# EAGLE design BC 09.02 (EAGLE 5.04)
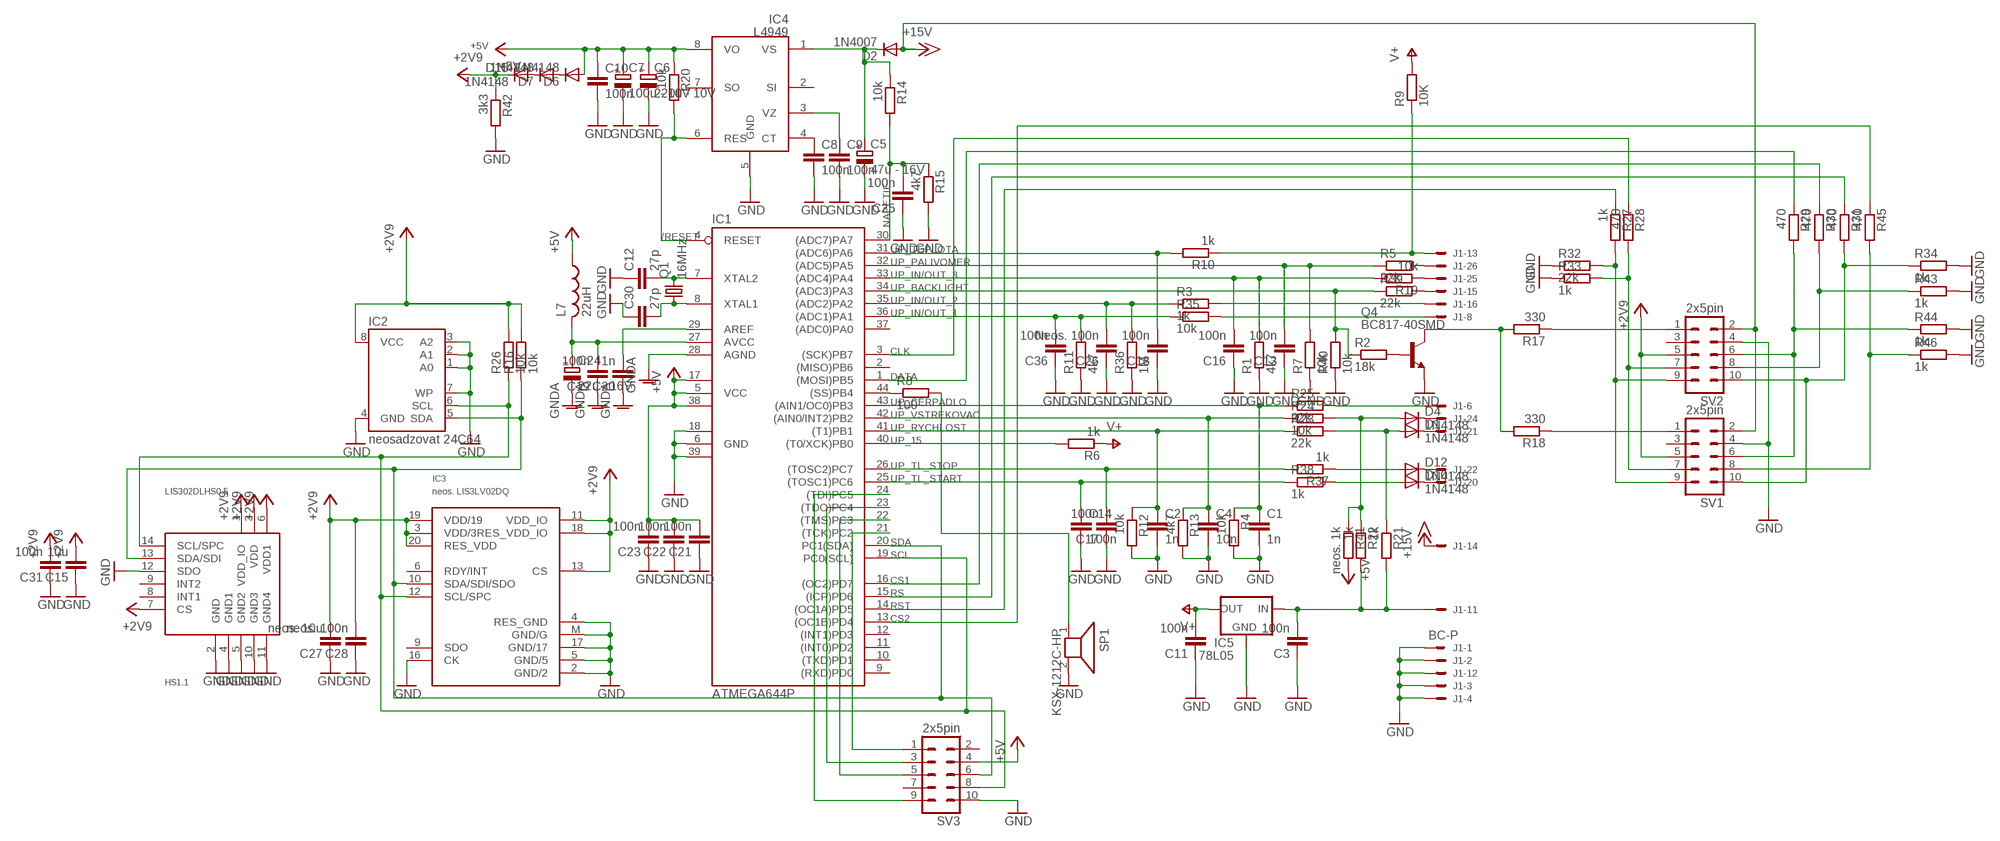
[diagram p0: schematic, sheet 1]

## Parts
C1  1n  C-EUC0805K  [C0805K]
C2  1n  C-EUC0805K  [C0805K]
C3  100n  C-EUC0805K  [C0805K]
C4  10n  C-EUC0805K  [C0805K]
C5  47u - 16V  CPOL-EUCT7343  [CT7343]
C6  220u - 10V  CPOL-EUCT7343  [CT7343]
C7  100u - 10V  CPOL-EUCT7343  [CT7343]
C8  100n  C-EUC0805K  [C0805K]
C9  100n  C-EUC0805K  [C0805K]
C10  100n  C-EUC0805K  [C0805K]
C11  100n  C-EUC0805K  [C0805K]
C12  27p  C-EUC0805K  [C0805K]
C13  100n  C-EUC0805K  [C0805K]
C14  100n  C-EUC0805K  [C0805K]
C15  10u  C-EUC0805K  [C0805K]
C16  100n  C-EUC0805K  [C0805K]
C17  100n  C-EUC0805K  [C0805K]
C18  100n  C-EUC0805K  [C0805K]
C19  100n  C-EUC0805K  [C0805K]
C20  1n  C-EUC0805K  [C0805K]
C21  100n  C-EUC0603K  [C0603K]
C22  100n  C-EUC0603K  [C0603K]
C23  100n  C-EUC0603K  [C0603K]
C24  22u - 16V  CPOL-EUCT6032  [CT6032]
C25  100n  C-EUC0805K  [C0805K]
C26  Neos. 100n  C-EUC0805K  [C0805K]
C27  neos. 10u  C-EUC0805K  [C0805K]
C28  neos. 100n  C-EUC0805K  [C0805K]
C30  27p  C-EUC0805K  [C0805K]
C31  100n  C-EUC0805K  [C0805K]
C36  100n  C-EUC0805K  [C0805K]
D1  1N4148  DIODE-0805  [D0805]
D2  1N4007  DIODE-DO214AA  [DO214AA]
D4  1N4148  DIODE-0805  [D0805]
D6  1N4148  DIODE-0805  [D0805]
D7  1N4148  DIODE-0805  [D0805]
D10  1N4148  DIODE-0805  [D0805]
D12  1N4148  DIODE-0805  [D0805]
D15  1N4148  DIODE-0805  [D0805]
HS1.1  LIS302DLHS0.5  [LGA14-0.5]
IC1  ATMEGA644P  MEGA16-A  [TQFP44]
IC2  neosadzovat 24C64  AT24C  [SOIC8]
IC3  neos. LIS3LV02DQ  LIS3LV02DQ  [QFN24]
IC4  L4949  L4949SMD  [SO08]
IC5  78L05  78LXX  [TO92]
J1  BC-P  [BC]
L7  22uH  L-USL3230M  [L3230M]
Q1  16MHz  CRYSTALHC49UP  [HC49UP]
Q4  BC817-40SMD  [SOT23-BEC]
R1  4k7  R-EU_M0805  [M0805]
R2  18k  R-EU_M0805  [M0805]
R3  1k  R-EU_M0805  [M0805]
R4  10k  R-EU_M0805  [M0805]
R5  22k  R-EU_M0805  [M0805]
R6  1k  R-EU_M0805  [M0805]
R7  10k  R-EU_M0805  [M0805]
R8  100  R-EU_M0805  [M0805]
R9  10K  R-EU_M0805  [M0805]
R10  1k  R-EU_M0805  [M0805]
R11  4k7  R-EU_M0805  [M0805]
R12  10k  R-EU_M0805  [M0805]
R13  4k7  R-EU_M0805  [M0805]
R14  10k  R-EU_M0805  [M0805]
R15  4k7  R-EU_M0805  [M0805]
R16  10k  R-EU_M0805  [M0805]
R17  330  R-EU_M0805  [M0805]
R18  330  R-EU_M0805  [M0805]
R19  10k  R-EU_M0805  [M0805]
R20  10k  R-EU_M0805  [M0805]
R21  1k  R-EU_M0805  [M0805]
R22  1k  R-EU_M0805  [M0805]
R23  22k  R-EU_M0805  [M0805]
R24  10k  R-EU_M0805  [M0805]
R25  22k  R-EU_M0805  [M0805]
R26  10k  R-EU_M0805  [M0805]
R27  1k  R-EU_M0805  [M0805]
R28  470  R-EU_M0805  [M0805]
R29  470  R-EU_M0805  [M0805]
R30  470  R-EU_M0805  [M0805]
R31  470  R-EU_M0805  [M0805]
R32  22k  R-EU_M0805  [M0805]
R33  1k  R-EU_M0805  [M0805]
R34  1k  R-EU_M0805  [M0805]
R35  10k  R-EU_M0805  [M0805]
R36  1M  R-EU_M0805  [M0805]
R37  1k  R-EU_M0805  [M0805]
R38  1k  R-EU_M0805  [M0805]
R39  22k  R-EU_M0805  [M0805]
R40  10k  R-EU_M0805  [M0805]
R41  neos. 1k  R-EU_M0805  [M0805]
R42  3k3  R-EU_M0805  [M0805]
R43  1k  R-EU_M0805  [M0805]
R44  1k  R-EU_M0805  [M0805]
R45  470  R-EU_M0805  [M0805]
R46  1k  R-EU_M0805  [M0805]
SP1  KSX-1212C-HP  AL60P  [AL60P]
SV1  2x5pin  MA05-2  [MA05-2]
SV2  2x5pin  MA05-2  [MA05-2]
SV3  2x5pin  MA05-2  [MA05-2]

## Nets
15: C3.2 IC5.3(IN) J1.11 R21.2 R22.2
+3V3: C15.2 C27.2 C28.2 C31.2 D15.2(C) HS1.1.1(VDD_IO) HS1.1.3(VDD) HS1.1.6(VDD1) HS1.1.7(CS) IC2.8(VCC) IC3.3(VDD/3) IC3.11(VDD_IO) IC3.13(CS) IC3.18(RES_VDD_IO) IC3.19(VDD/19) IC3.20(RES_VDD) R16.2 R26.2 R42.1 SV1.5 SV2.5 ; supply symbol labelled +2V9
+5V: C6.+ C7.+ C10.1 C21.2 C22.2 C23.2 D6.1(A) IC1.5(VCC) IC1.17(VCC1) IC1.38(VCC2) IC4.8(VO) L7.1 R20.1 R41.2 SV3.4
+15V: D2.A J1.14 SV1.2 SV2.2
/RESET: IC1.4(RESET) IC4.6(RES) R20.2
AREF: C20.2 IC1.29(AREF)
AVCC: C19.2 C24.+ IC1.27(AVCC) L7.2
BACK_LIGHT: J1.15 R39.2
BL-: R17.1 SV2.1
CERPADLO: J1.6 R25.2
CLK: IC1.3((SCK)PB7) R28.1
CLKL: R28.2 R33.2 SV1.7 SV2.7
CS1: IC1.16((OC2)PD7) R30.1
CS1L: R45.2 R46.1 SV1.8
CS2: IC1.13((OC1B)PD4) R45.1
CSL: R30.2 R43.1 SV2.8
DATA: IC1.1((MOSI)PB5) R29.1
DATAL: R29.2 R44.1 SV1.6 SV2.6
GND: C1.2 C2.2 C3.1 C4.2 C5.- C6.- C7.- C8.2 C9.2 C10.2 C11.1 C12.1 C13.1 C14.2 C15.1 C16.1 C17.1 C18.1 C21.1 C22.1 C23.1 C25.1 C26.1 C27.1 C28.1 C30.1 C31.1 C36.1 HS1.1.2(GND) HS1.1.4(GND1) HS1.1.5(GND2) HS1.1.10(GND3) HS1.1.11(GND4) HS1.1.12(SDO) IC1.6(GND) IC1.18(GND1) IC1.39(GND2) IC2.1(A0) IC2.2(A1) IC2.3(A2) IC2.4(GND) IC2.7(WP) IC3.2(GND/2) IC3.4(RES_GND) IC3.5(GND/5) IC3.16(CK) IC3.17(GND/17) IC3.M(GND/G) IC4.5(GND) IC5.2(GND) J1.1 J1.2 J1.3 J1.4 J1.12 Q4.E R1.1 R4.2 R7.1 R11.1 R12.2 R13.2 R15.2 R32.1 R33.1 R34.2 R36.1 R40.1 R42.2 R43.2 R44.2 R46.2 SP1.2 SV1.4 SV2.4 SV3.10
GNDA: C19.1 C20.1 C24.- IC1.28(AGND)
IN/OUT_1: J1.8 R35.2
IN/OUT_2: J1.16 R3.2
N$1: IC1.21((TCK)PC2) SV3.1
N$2: D10.2(C) J1.20
N$3: J1.25 R19.1
N$4: D1.2(C) J1.21
N$5: D12.1(A) R37.1
N$6: D4.2(C) J1.24
N$7: D6.2(C) D7.1(A)
N$8: D1.1(A) R21.1 R23.2
N$9: IC1.23((TDO)PC4) SV3.3
N$10: C8.1 IC4.4(CT)
N$11: D7.2(C) D15.1(A)
N$12: C9.1 IC4.3(VZ)
N$13: C12.2 IC1.7(XTAL2) Q1.2
N$14: Q4.C R17.2 R18.2
N$16: R18.1 SV1.1
N$17: C30.2 IC1.8(XTAL1) Q1.1
N$18: IC1.22((TMS)PC3) SV3.5
N$19: IC1.24((TDI)PC5) SV3.9
N$22: Q4.B R2.2
N$24: IC1.44((SS)PB4) R8.1
N$25: D4.1(A) R22.1 R24.2 R41.1
N$28: R8.2 SP1.1
N$34: D10.1(A) R38.2
N$46: C5.+ D2.C IC4.1(VS) R14.1
NAPETIE: C25.2 IC1.30((ADC7)PA7) R14.2 R15.1
PALIVOMER: J1.26 R5.2
RS: IC1.15((ICP)PD6) R31.1
RSL: R31.2 R34.1 SV1.10 SV2.10
RST: IC1.14((OC1A)PD5) R27.1
RSTL: R27.2 R32.2 SV1.9 SV2.9
SCL: HS1.1.14(SCL/SPC) IC1.19(PC0(SCL)) IC2.6(SCL) IC3.12(SCL/SPC) R26.1 SV3.8
SDA: HS1.1.13(SDA/SDI) IC1.20(PC1(SDA)) IC2.5(SDA) IC3.10(SDA/SDI/SDO) R16.1 SV3.6
TEPLOTA: J1.13 R9.1 R10.1
TL_STOP: D12.2(C) J1.22
UP_15: IC1.40((T0/XCK)PB0) R6.2
UP_BACKLIGHT: IC1.34((ADC3)PA3) R2.1 R39.1 R40.2
UP_CERPADLO: C1.1 IC1.43((AIN1/OC0)PB3) R4.1 R25.1
UP_IN/OUT_1: C36.2 IC1.36((ADC1)PA1) R11.2 R35.1
UP_IN/OUT_2: C26.2 IC1.35((ADC2)PA2) R3.1 R36.2
UP_IN/OUT_3: C16.2 IC1.33((ADC4)PA4) R1.2 R19.2
UP_PALIVOMER: C13.2 IC1.32((ADC5)PA5) R5.1 R7.2
UP_RYCHLOST: C2.1 IC1.41((T1)PB1) R12.1 R23.1
UP_TEPLOTA: C18.2 IC1.31((ADC6)PA6) R10.2
UP_TL_START: C14.1 IC1.25((TOSC1)PC6) R38.1
UP_TL_STOP: C17.2 IC1.26((TOSC2)PC7) R37.2
UP_VSTREKOVAC: C4.1 IC1.42((AIN0/INT2)PB2) R13.1 R24.1
V+: C11.2 IC5.1(OUT) R6.1 R9.2
Unconnected: HS1.1.8(INT1) HS1.1.9(INT2) IC1.2((MISO)PB6) IC1.9((RXD)PD0) IC1.10((TXD)PD1) IC1.11((INT0)PD2) IC1.12((INT1)PD3) IC1.37((ADC0)PA0) IC3.6(RDY/INT) IC3.9(SDO) IC4.2(SI) IC4.7(SO) J1.5 J1.7 J1.9 J1.10 J1.17 J1.18 J1.19 J1.23 SV1.3 SV2.3 SV3.2 SV3.7

## Library data of the parts
C1-C4 C8-C23 C25-C28 C30 C31 C36 = rcl:C-EU: CAPACITOR, European symbol
C5-C7 C24 = rcl:CPOL-EU: POLARIZED CAPACITOR, European symbol
D1 D2 D4 D6 D7 D10 D12 D15 = diode:DIODE-: DIODE
HS1.1 = LIS302DL:LIS302DL: 3-axis accelerometer www.st.com
IC1 = atmel:MEGA16: MICROCONTROLLER 16 Kbytes FLASH 1 kbytes SRAM 512 bytes EEPROM USART 8-channel 10 bit ADC Source: avr.lbr
IC2 = atmel:AT24C*: 2-wire serial EEPROM
IC3 = Pepo:LIS3LV02DQ
IC4 = linear:L4949
IC5 = v-reg:78LXX: VOLTAGE REGULATOR
J1 = Pepo:BC-P
L7 = rcl:L-US: INDUCTOR, American symbol
Q1 = crystal:CRYSTAL: CRYSTAL
Q4 = transistor-npn:BC817*: NPN Transistor
R1-R46 = rcl:R-EU_: RESISTOR, European symbol
SP1 = buzzer:AL60P: SPEAKER Source: Buerklin
SV1-SV3 = con-lstb:MA05-2: PIN HEADER

## Board
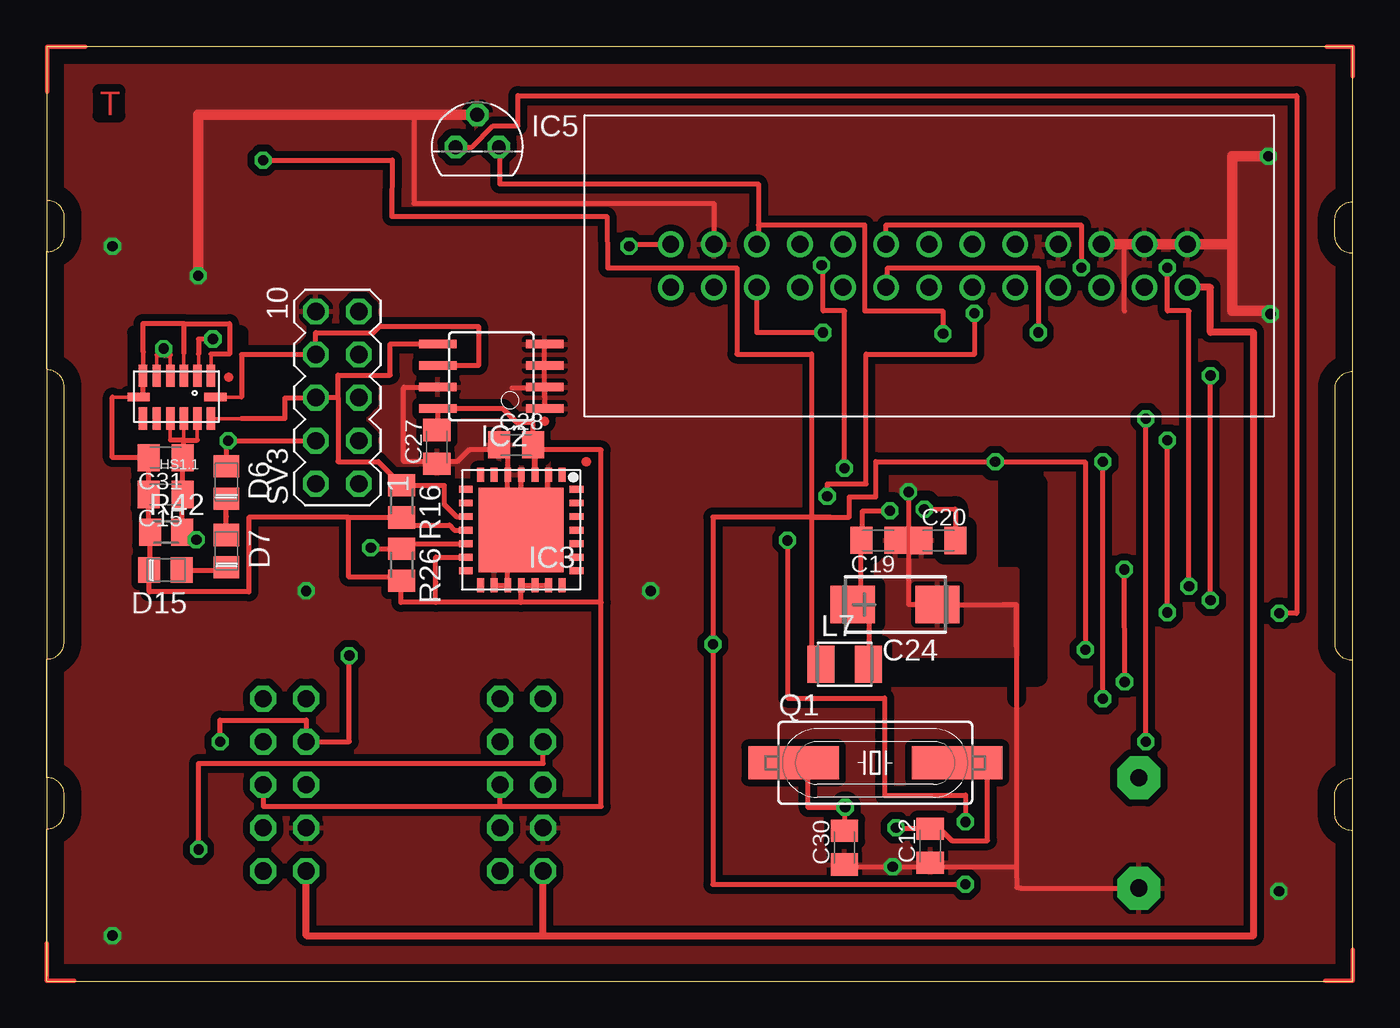
[diagram p1: board, top side]
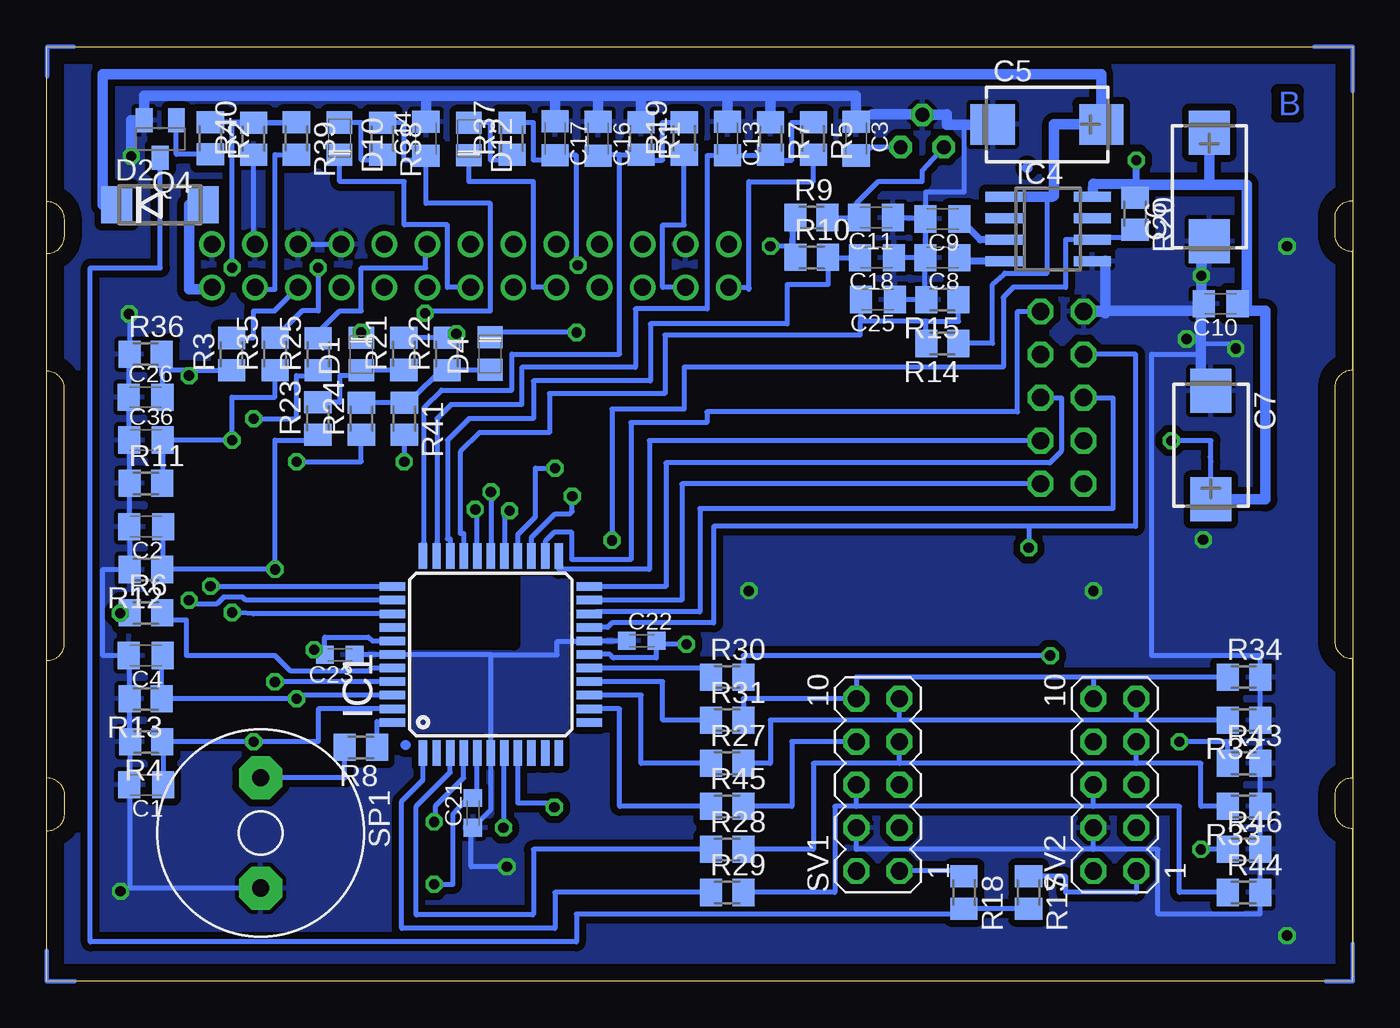
[diagram p2: board, bottom side, seen from below]

Size 77.03 x 55.09 mm. Coordinates in mm from the lower left corner, seen from the top.
Outline: 77.03,55.09 0.01,55.08
Outline: 0.03,0 77,0
Outline: 0.03,8.98 arc90 1.03,9.98 1.03,10.99 arc90 0.04,11.99
Outline: 0.05,19 arc90 1.03,20 1.03,35.03 arc90 0,36.04
Outline: 0.03,43 arc90 1.05,44.03 1.05,45.05 arc90 0.02,46.01
Outline: 0.01,0 0.01,8.98
Outline: 0.01,11.99 0.01,18.99 arc-90 0.05,19
Outline: 0.01,36.11 0.01,43.04 arc-91 0.03,43
Outline: 0.01,55.08 0.01,0.29
Outline: 77.03,8.86 arc-90 75.97,9.89 75.97,10.93 arc-90 77.02,11.97
Outline: 77.02,18.91 arc-90 75.99,19.89 75.99,34.93 arc-90 77.03,35.95
Outline: 77.02,42.9 arc-90 75.99,43.92 75.99,44.93 arc-90 77.03,45.94
Outline: 76.98,0 77.03,0 77.03,8.87
Outline: 77.03,11.97 77.03,18.9
Outline: 77.03,35.95 77.03,42.9
Outline: 77.03,0.22 77.03,55.08
Copper layers (1*16): Top 0.035mm / dielectric 1.5mm / Bottom 0.035mm
Design rules "default *": minimum track width 0.2mm, minimum drill 23mil, track to track 0.2mm, track to pad 0.2mm, pad to pad 0.2mm, via to via 0.2mm, smd to smd 0.2mm, copper to edge 40mil, drill to drill 8mil, minimum pad ring 10mil, minimum via ring 8mil, stop-mask expansion 4mil, vias tented up to drill 0mil, thermal gap 10mil
tRestrict: area 5.1,30.6 to 11.5,38.2; area 7.7,25.5 to 10.2,30.6; 2 lines
bRestrict: area 49.5,19.9 to 57.1,27.5

### Footprints (pad centres in the part's own frame; a part is rotated, then mirrored left to right if it is on the bottom)
C0805K = smd 1.3 x 1.6: 1 -1,0; 2 1,0
CT7343 = smd 2.6 x 2.4: + 3.2,0; - -3.2,0
C0603K = smd 1.05 x 1.08: 1 -0.875,0; 2 0.875,0
CT6032 = smd 2.6 x 2.2: + 2.5,0; - -2.5,0
D0805 = smd 1.3 x 1.5: 1 -0.95,0; 2 0.954,0
DO214AA = smd 1.8 x 2.2: A 2.55,0; C -2.55,0
LGA14-0.5 = smd 0.5 x 1.3: 1 2,1.262; 2 1.2,1.262; 3 0.4,1.262; 4 -0.4,1.262; 5 -1.2,1.262; 6 -2,1.262; 8 -2,-1.262; 9 -1.2,-1.262; 10 -0.4,-1.262; 11 0.4,-1.262; 12 1.2,-1.262; 13 2,-1.262 | smd 1.3 x 0.5: 7 -2.263,0; 14 2.263,0
TQFP44 = smd 1.5 x 0.5: 1 -5.8,4; 2 -5.8,3.2; 3 -5.8,2.4; 4 -5.8,1.6; 5 -5.8,0.8; 6 -5.8,0; 7 -5.8,-0.8; 8 -5.8,-1.6; 9 -5.8,-2.4; 10 -5.8,-3.2; 11 -5.8,-4; 23 5.8,-4; 24 5.8,-3.2; 25 5.8,-2.4; 26 5.8,-1.6; 27 5.8,-0.8; 28 5.8,0; 29 5.8,0.8; 30 5.8,1.6; 31 5.8,2.4; 32 5.8,3.2; 33 5.8,4 | smd 0.5 x 1.5: 12 -4,-5.8; 13 -3.2,-5.8; 14 -2.4,-5.8; 15 -1.6,-5.8; 16 -0.8,-5.8; 17 0,-5.8; 18 0.8,-5.8; 19 1.6,-5.8; 20 2.4,-5.8; 21 3.2,-5.8; 22 4,-5.8; 34 4,5.8; 35 3.2,5.8; 36 2.4,5.8; 37 1.6,5.8; 38 0.8,5.8; 39 0,5.8; 40 -0.8,5.8; 41 -1.6,5.8; 42 -2.4,5.8; 43 -3.2,5.8; 44 -4,5.8
SOIC8 = smd 0.5 x 2.2: 1 -1.905,-3.154; 2 -0.645,-3.154; 3 0.625,-3.154; 4 1.895,-3.154; 5 1.905,3.154; 6 0.635,3.154; 7 -0.635,3.154; 8 -1.905,3.154
QFN24 = smd 0.406 x 0.813: 1 0.8,-0.069; 2 1.6,-0.069; 3 2.4,-0.069; 4 3.2,-0.069; 5 4,-0.069; 6 4.8,-0.069; 7 5.6,-0.069; 15 5.6,6.457; 16 4.8,6.457; 17 4,6.457; 18 3.2,6.457; 19 2.4,6.457; 20 1.6,6.457; 21 0.8,6.457 | smd 0.813 x 0.406: 8 6.468,0.8; 9 6.468,1.6; 10 6.468,2.4; 11 6.468,3.2; 12 6.468,4; 13 6.468,4.8; 14 6.468,5.6; 22 -0.049,5.6; 23 -0.049,4.8; 24 -0.049,4; 25 -0.049,3.2; 26 -0.049,2.4; 27 -0.049,1.6; 28 -0.049,0.8 | smd 5 x 5: M 3.214,3.197
SO08 = smd 0.6 x 2.2: 1 -1.905,-2.6; 2 -0.635,-2.6; 3 0.635,-2.6; 4 1.905,-2.6; 5 1.905,2.6; 6 0.635,2.6; 7 -0.635,2.6; 8 -1.905,2.6
TO92 = drill 0.813 octagon: 1 -1.27,0; 2 0,1.905; 3 1.27,0
BC = drill 1 round: 1 0,0; 2 2.54,0; 3 5.08,0; 4 7.62,0; 5 10.16,0; 6 12.7,0; 7 15.24,0; 8 17.78,0; 9 20.32,0; 10 22.86,0; 11 25.4,0; 12 27.94,0; 13 30.48,0; 14 0,2.54; 15 2.54,2.54; 16 5.08,2.54; 17 7.62,2.54; 18 10.16,2.54; 19 12.7,2.54; 20 15.24,2.54; 21 17.78,2.54; 22 20.32,2.54; 23 22.86,2.54; 24 25.4,2.54; 25 27.94,2.54; 26 30.48,2.54
L3230M = smd 1.6 x 2.2: 1 -1.4,0; 2 1.4,0
HC49UP = smd 5.334 x 1.93: 1 -4.826,0; 2 4.826,0
SOT23-BEC = smd 1 x 1.4: B -0.95,-1.1; C 0,1.1; E 0.95,-1.1
M0805 = smd 1.3 x 1.6: 1 -0.95,0; 2 0.95,0
AL60P = drill 1.016 pad 2.54 octagon: 1 -3.251,0; 2 3.251,0
MA05-2 = drill 1.016 octagon: 1 -5.08,-1.27; 2 -5.08,1.27; 3 -2.54,-1.27; 4 -2.54,1.27; 5 0,-1.27; 6 0,1.27; 7 2.54,-1.27; 8 2.54,1.27; 9 5.08,-1.27; 10 5.08,1.27

### Placement (x,y rotation side)
C1  71.17,11.57 180 bottom
C2  71.18,26.8 180 bottom
C3  29.29,49.68 270 bottom
C4  71.19,19.19 180 bottom
C5  18.04,50.51 0 bottom
C6  8.46,46.83 90 bottom
C7  8.37,31.6 270 bottom
C8  24.2,42.65 180 bottom
C9  24.2,44.94 180 bottom
C10  7.8,39.94 180 bottom
C11  28.11,45.02 180 bottom
C12  52.11,7.97 90 top
C13  36.88,49.68 270 bottom
C14  54.67,49.67 90 bottom
C15  7.01,28.69 180 top
C16  44.52,49.67 270 bottom
C17  47.06,49.69 270 bottom
C18  28.07,42.65 180 bottom
C19  49.05,25.98 180 top
C20  52.61,25.98 0 top
C21  51.9,9.92 90 bottom
C22  41.95,20.06 0 bottom
C23  59.76,19.24 180 bottom
C24  50.04,22.2 180 top
C25  28.01,40.18 180 bottom
C26  71.21,34.42 0 bottom
C27  23.01,31.49 90 top
C28  27.68,31.61 0 top
C30  47.06,7.87 90 top
C31  7.02,30.86 180 top
C36  71.19,31.9 0 bottom
D1  58.49,36.97 90 bottom
D2  70.36,45.77 0 bottom
D4  50.89,37 90 bottom
D6  10.6,29.4 270 top
D7  10.61,25.35 270 top
D10  59.76,49.67 270 bottom
D12  52.14,49.65 270 bottom
D15  7.01,24.23 180 top
HS1.1  7.69,34.43 0 top
IC1  50.84,19.25 90 bottom
IC2  26.22,35.66 90 top
IC3  31.2,29.79 180 top
IC4  17.96,44.34 270 bottom
IC5  25.39,49.17 0 top
J1  67.29,43.44 180 top
L7  47.07,18.68 0 top
Q1  48.88,12.87 0 top
Q4  70.34,49.65 180 bottom
R1  41.99,49.68 270 bottom
R2  67.39,49.69 270 bottom
R3  66.14,36.97 90 bottom
R4  71.18,14.1 180 bottom
R5  31.82,49.68 270 bottom
R6  71.19,21.71 0 bottom
R7  34.34,49.68 270 bottom
R8  58.51,13.78 180 bottom
R9  31.93,45.02 0 bottom
R10  31.92,42.67 0 bottom
R11  71.18,29.34 0 bottom
R12  71.19,24.27 180 bottom
R13  71.19,16.64 180 bottom
R14  24.21,37.59 180 bottom
R15  24.21,40.18 180 bottom
R16  20.94,28.28 270 top
R17  19.12,5.22 270 bottom
R18  22.93,5.22 270 bottom
R19  39.44,49.68 90 bottom
R20  12.84,45.24 270 bottom
R21  55.97,36.98 90 bottom
R22  53.43,36.98 90 bottom
R23  61.04,33.17 90 bottom
R24  58.48,33.16 90 bottom
R25  61.02,36.96 90 bottom
R26  20.94,24.55 270 top
R27  36.9,12.84 0 bottom
R28  36.9,7.76 0 bottom
R29  36.9,5.22 0 bottom
R30  36.9,17.92 0 bottom
R31  36.9,15.38 0 bottom
R32  6.42,15.38 180 bottom
R33  6.42,10.3 180 bottom
R34  6.42,17.92 0 bottom
R35  63.56,36.97 90 bottom
R36  71.2,36.96 0 bottom
R37  49.59,49.67 90 bottom
R38  57.24,49.66 270 bottom
R39  62.31,49.68 270 bottom
R40  64.84,49.67 90 bottom
R41  55.94,33.16 270 bottom
R42  7.05,26.47 0 top
R43  6.42,12.84 0 bottom
R44  6.42,5.22 0 bottom
R45  36.9,10.3 0 bottom
R46  6.42,7.76 0 bottom
SP1  64.42,8.73 270 bottom
SV1  28.01,11.57 90 bottom
SV2  14.04,11.57 90 bottom
SV3  17.14,34.4 90 top

### Tracks (layer width: path | path; a pad name or v marks a point on that pad's centre or on a via)
15  (via drill 0.6)
  Top 0.305: IC5.3 26.66,49.23 26.74,49.23 26.74,47 41.98,47 41.98,44.59 | v52.87,38.16 52.85,39.51 48.24,39.51 48.24,44.59 41.98,44.59 | 41.98,44.59 41.98,43.44 J1.11
  Bottom 0.305: IC5.3 28.34,49.18 C3.2 | R21.2 55.97,38.24 55.95,38.24 55.95,37.93 R22.2 53.43,37.93 v52.87,38.16
+3V3
  Top 0.2: 9.69,36.97 HS1.1.1 | 8.09,37.02 HS1.1.3 | 3.88,34.42 HS1.1.7
  Top 0.254: 8.09,38.77 | 5.69,37.08 HS1.1.6 | 8.09,37.02 | 3.88,34.43 3.88,34.42
  Top 0.305: 28.8,23.34 28.73,23.34 | IC3.20 29.6,23.34 28.8,23.34 | 28.8,23.34 IC3.19 | 28.8,23.34 28,23.34 IC3.18 27.98,23.33 27.98,22.33 | 24.66,25 24.66,24.99 IC3.13 | 24.66,25 24.66,25.01 | IC3.11 24.04,26.59 23.75,26.88 20.39,26.88 20.39,27.33 R16.2 17.81,27.33 | 28.92,31.36 28.92,31.61 C28.2 | C28.2 28.96,31.61 28.96,31.32 28.78,31.32 28.78,29.86 IC3.3 28.8,31.32 32.7,31.32 32.7,22.33 | HS1.1.6 5.69,34.43 HS1.1.7 | C27.2 IC2.8 26.92,33.75 27.74,32.93 28.68,32.93 C28.2 | 24.66,25 22.95,25 22.95,23.53 | 20.94,23.53 R26.2 20.89,23.6 20.89,22.33 | 22.95,22.33 22.95,23.53 | 27.98,22.33 22.95,22.33 | 32.7,22.33 27.98,22.33 | 22.95,22.33 20.89,22.33 | 22.95,23.53 22.95,23.49 | 24.2,10.3 12.77,10.3 SV2.5 | SV1.5 26.74,10.3 24.2,10.3 | 24.2,10.3 32.7,10.3 32.7,22.33 | 17.81,27.33 11.92,27.33 11.92,22.94 6.06,22.94 D15.2 6.1,24.23 R42.1 6.01,26.47 C15.2 C31.2 3.88,30.86 3.88,34.43 | 20.89,22.33 20.89,23.81 17.81,23.81 17.81,27.33 | 5.69,38.77 8.09,38.77 8.09,37.02 | 9.69,36.97 10.79,36.97 10.79,38.77 8.09,38.77 | 5.69,38.77 | 5.69,37.08 5.69,38.77
+5V  (via drill 0.6)  (1 unrouted)
  Top 0.305: L7.1 45.11,18.68 45.11,27.36 | 45.11,27.36 45.11,27.37 | 45.11,27.36 45.11,36.97 40.71,36.97 40.71,42.05 33.09,42.05 33.05,45.09 20.35,45.09 20.39,48.4 v12.77,48.4 | 45.11,27.36 46.2,27.36 | 46.2,27.36 47.34,27.36 47.34,28.54 48.9,28.54 48.9,30.63 v55.94,30.61 61.26,30.61 v61.26,19.53 | 46.2,27.36 39.29,27.36 v39.29,19.87 39.29,5.71 v54.18,5.71 | SV3.4 v10.71,31.86 10.6,31.86 D6.1 | v55.95,30.62 v55.94,30.62
  Bottom 0.305: 51.64,10.8 | 51.64,10.8 C21.2 52,10.91 52.04,10.95 53.07,9.82 53.07,5.71 v54.18,5.71 | IC1.5 51.64,10.8 | IC1.17 43.83,19.25 43.62,19.05 41.09,19.05 41.09,20.06 C22.2 40.88,19.87 v39.29,19.87 | C6.+ | 8.46,46.96 8.45,46.96 | 6.27,39.94 C10.1 | C7.+ 8.37,30.94 8.41,30.9 8.38,30.87 | v61.26,19.53 61.26,19.24 C23.2 60.63,20.28 58.05,20.28 57.83,20.05 IC1.38 | 12.18,46.96 12.18,46.95 12.14,46.95 R20.1 | v55.95,30.62 v55.94,30.62 R41.2 | C7.+ 8.37,30.62 | C7.+ 8.37,31.86 v10.71,31.86
  Bottom 0.406: v12.77,48.4 12.77,46.97
  Bottom 0.61: IC4.8 15.31,47 12.77,46.97 12.18,46.96 8.45,46.96 C6.+ 8.45,50.05 | 8.45,46.96 6.27,46.96 6.27,39.94 6.27,39.51 5.15,39.51 5.15,28.4 C7.+
+15V
  Top 0.406: SV2.2 15.31,2.68 29.28,2.68 | 29.28,2.68 SV1.2 | 29.28,2.68 71.19,2.68 71.19,38.24 68.65,38.24 68.65,40.9 J1.14
  Bottom 0.61: J1.14 67.29,40.78 68.65,40.78 68.65,45.77 D2.A
/RESET  (via drill 0.6)
  Top 0.305: v54.19,9.38 54.19,10.96 49.43,10.95 49.43,16.69 43.7,16.69 v43.7,25.98
  Bottom 0.305: IC1.4 52.44,11.98 54.1,10.34 54.09,9.39 54.1,9.38 v54.19,9.38 | R20.2 13.13,43.82 14.49,43.82 IC4.6 14.45,43.7 16.95,43.71 16.95,40.91 20.02,40.91 20.62,40.31 20.62,36.19 39.44,36.19 39.44,33.73 43.7,33.73 v43.7,25.98
AREF  (via drill 0.6)
  Top 0.305: v51.76,27.81 51.88,27.82 53.59,27.84 C20.2
  Bottom 0.305: IC1.29 51.64,27.47 v51.76,27.81
AVCC  (via drill 0.6)
  Top 0.305: C24.+ 47.54,22.19 48.04,22.19 | 48.04,22.19 48.49,22.19 48.49,18.68 L7.2 | v49.73,27.73 | v49.73,27.73 49.73,27.74 | v49.73,27.73 | v49.73,27.73 48.12,27.73 48.12,25.74 C19.2 48.04,25.74 | 48.04,25.74 48.04,25.75 | 48.04,22.19 48.04,25.74
  Top 0.406: 47.99,22.2 47.99,22.26 | C24.+ 47.99,22.2 | 48.04,22.19 47.99,22.19 47.99,22.2
  Bottom 0.305: IC1.27 50.04,27.38 v49.73,27.73
BACK_LIGHT
  Bottom 0.305: R39.2 63.57,48.73 63.57,40.78 64.75,40.78 J1.15
BL-
  Bottom 0.305: SV2.1 12.77,5.22 16.92,5.22 16.92,6.17 R17.1
CERPADLO
  Bottom 0.305: R25.2 61.02,38.25 59.76,39.51 58.49,39.51 58.49,42.05 54.68,42.05 54.68,43.36 J1.6
CLK
  Bottom 0.305: IC1.3 53.24,12.31 55.24,10.31 55.24,3.91 48.37,3.91 48.33,3.95 48.33,7.76 R28.1
CLKL
  Bottom 0.305: R28.2 31.82,7.76 31.82,12.84 26.74,12.84 | 26.74,12.84 SV1.7 | 12.77,12.84 26.74,12.84 | 12.77,12.84 SV2.7 | 12.77,12.84 8.96,12.84 8.96,10.3 R33.2
CS1
  Bottom 0.305: IC1.16 37.85,18.45 R30.1
CS1L  (via drill 0.6)
  Top 0.305: SV1.8 29.28,12.84 8.96,12.84 v8.96,7.76
  Bottom 0.305: R45.2 33.09,10.3 33.09,14.11 SV1.8 | R46.1 v8.96,7.76
CS2
  Bottom 0.305: IC1.13 43.25,16.05 43.25,10.3 R45.1
CSL  (via drill 0.6)
  Top 0.305: v17.85,19.19 17.85,14.11 SV2.8 15.31,15.38 10.23,15.38 v10.23,14.11
  Bottom 0.305: R30.2 35.95,19.19 v17.85,19.19 | v10.23,14.11 7.37,14.11 R43.1
DATA
  Bottom 0.305: IC1.1 54.84,11.86 56.1,10.6 56.1,3.1 47.06,3.1 47.06,5.22 R29.1
DATAL
  Bottom 0.305: 29.28,10.3 SV1.6 | 15.31,10.3 29.28,10.3 | R29.2 30.55,5.22 30.55,10.3 29.28,10.3 | 15.31,10.3 SV2.6 | 15.31,10.3 10.23,10.3 10.23,5.22 R44.1
GND  (via drill 0.6)
  Top 0.2: 8.09,31.89 HS1.1.11 | 8.89,31.89 HS1.1.12 | 7.29,31.89 HS1.1.10 | 6.49,36.91 HS1.1.5 | 7.29,36.91 HS1.1.4 | 8.96,36.97 8.96,35.69
  Top 0.254: 8.96,35.76 HS1.1.2 8.96,35.69
  Top 0.305: 67.18,43.43 J1.1 | IC3.M 27.4,25.98 27.98,25.96 | 27.98,25.96 29.55,25.98 29.55,29.86 IC3.2 29.63,29.83 | 27.19,25.98 27.19,25.82 | IC3.M 27.19,25.98 | 27.19,25.98 IC3.5 27.2,31.32 | IC3.4 27.98,29.84 27.98,25.96 | 27.2,31.32 C28.1 26.9,31.32 | 27.2,25.99 27.39,25.99 IC3.M | 27.2,25.99 IC3.17 27.2,23.34 26.4,23.34 IC3.16 | 27.2,25.99 27.15,25.99 | J1.12 39.35,45.86 21.66,45.86 21.66,51.07 | C30.1 47.06,6.73 49.81,6.73 | C12.1 52.11,6.73 v49.9,6.73 49.81,6.73 | 69.92,43.33 69.92,43.44 | 72.18,39.51 v72.18,39.33 | SP1.2 57.45,5.48 57.21,5.52 57.21,6.55 57.22,6.55 57.22,16.65 | 49.81,6.73 49.81,6.74 57.22,6.74 | IC2.4 IC2.3 IC2.2 29.37,34.43 | 29.37,34.43 IC2.1 | 27.44,34.97 29.37,34.98 29.37,34.43 | IC2.7 21.06,35.02 21.06,30.62 23.14,30.62 | 27.2,31.32 24.9,31.32 24.2,30.62 23.14,30.62 | 23.14,30.62 C27.1 | 63.57,39.51 63.57,43.32 | 8.09,31.89 8.09,30.86 C31.1 C15.1 8,28.69 R42.2 8,26.02 v8.83,26.02 | 8.09,31.89 8.89,31.89 | 8.09,31.89 7.29,31.89 | v9.8,37.86 8.95,37.86 8.95,36.97 8.96,36.97 | 6.9,36.91 6.49,36.91 | 6.9,36.91 7.29,36.91 | v6.9,37.29 6.9,36.91
  Top 0.61: 8.94,41.6 8.94,50.94 | 8.94,50.94 8.94,51.09 | IC5.2 21.66,51.07 8.94,51.07 8.94,50.94 | 67.18,43.43 67.18,43.44 J1.2 J1.3 | 69.92,43.44 J1.1 | 72.18,39.51 69.92,39.51 69.92,43.33 69.92,48.63 v72.05,48.63
  Bottom 0.254: v6.9,37.29 7.08,37.58 8.96,37.58 | v9.8,37.86 9.34,37.8 8.96,37.8
  Bottom 0.305: 52,8.97 52.06,8.91 | 52,8.97 C21.1 | 52,8.97 50.84,10.13 IC1.6 50.84,19.24 | 50.84,19.24 50.84,19.23 46.93,19.23 46.92,20.03 45.04,20.03 IC1.18 42.77,20.06 | 50.84,19.24 50.84,19.23 | IC1.39 | 50.84,19.24 IC1.39 | 42.77,20.06 | 42.77,20.06 C22.1 | 14.69,42.45 14.61,42.47 IC4.5 | 8.91,39.94 8.91,39.92 | 8.91,39.94 C10.2 8.8,39.87 | 8.91,43.63 C6.- | 21.24,50.49 C5.- | C9.2 25.2,44.78 | 25.2,44.91 25.21,44.91 | C9.2 25.2,44.91 | 25.2,43.6 25.2,44.91 | 25.2,43.6 C8.2 | 25.13,42.65 25.13,42.66 | C8.2 25.13,42.65 | 25.13,42.65 | C8.2 25.21,42.62 | 58.69,19.24 | 58.69,19.24 C23.1 | IC1.39 58.69,19.24 | 58.69,19.24 58.69,19.38 | 52,8.97 52,6.73 v49.9,6.73 49.9,6.49 49.88,6.49 49.88,6.75 | J1.1 | C9.2 25.24,44.98 27.07,44.98 C11.1 | 28.39,51.11 28.34,51.11 C3.1 28.34,51.17 | IC5.2 25.39,51.11 | 23.94,50.47 23.94,50.49 23.93,50.49 | 8.91,39.46 8.91,39.94 | 25.27,42.06 25.28,42.78 | C9.2 25.2,46.51 22.93,46.51 22.93,50.49 | 21.79,50.49 21.79,50.4 21.83,50.4 | 15.88,39.46 SV3.10 | 15.88,39.46 | 15.88,39.46 15.88,39.45 | C8.2 | C8.2 C18.1 | C8.2 25.2,42.06 25.27,42.06 | 36.9,52.21 36.88,52.21 | 41.98,52.21 41.99,52.21 | 44.52,52.21 | 72.13,11.57 C1.2 | 72.13,11.57 R4.2 72.14,14.1 R13.2 | R13.2 72.19,16.64 | 72.19,29.34 R11.1 | 72.19,29.34 C36.1 72.21,31.9 C26.1 72.21,36.96 R36.1 72.15,39.33 v72.18,39.33 | J1.3 J1.4 | 25.27,42.06 25.27,40.29 R15.2 C25.1 | R40.1 64.84,43.53 J1.2 | R12.2 72.14,26.8 C2.2 72.18,29.34 72.19,29.34 | C4.2 | C4.2 72.14,19.19 R13.2 | 72.13,11.57 72.13,5.48 SP1.2 | 25.2,43.6 25.2,43.79 | SV1.4 29.28,7.76 15.31,7.76 | 15.31,7.76 11.5,7.76 11.5,3.95 5.47,3.95 R44.2 R46.2 R33.1 R43.2 R32.1 R34.2 5.47,19.19 11.86,19.19 11.86,36.97 8.96,36.97 | 15.31,7.76 SV2.4
  Bottom 0.305: C4.2 73.73,19.19 73.73,24.27 72.46,24.27 | 47.06,52.21
  Bottom 0.406: J1.2 64.84,43.44
  Bottom 0.61: 8.91,39.94 v8.94,41.59 | 21.24,50.49 21.79,50.49 22.93,50.49 23.93,50.49 | 25.39,51.11 28.34,51.11 | 23.94,51.07 23.94,50.49 | 15.88,39.46 14.58,39.46 14.58,39.39 14.61,39.39 14.61,39.52 14.61,42.47 | 15.88,39.46 | v8.94,41.59 8.94,42.97 | v8.94,41.59 8.94,42.22 8.94,42.31 8.91,42.31 | 8.91,42.31 8.91,43.63 | 8.91,42.31 8.9,42.31 | 23.94,51.07 23.94,51.11 | IC5.2 23.94,51.07 | 54.67,52.21 C14.2 | 34.34,52.21 R7.1 | 34.34,52.21 36.9,52.21 41.98,52.21 44.52,52.21 47.06,52.21 | 47.06,52.21 54.67,52.21 | 36.88,52.21 C13.1 | 41.99,52.21 R1.1 | 44.52,52.21 C16.1 | 47.06,52.21 C17.1 | 54.67,52.21 71.29,52.21 Q4.E 72.05,50.75 v72.05,48.63 | C3.1 29.3,52.21 34.34,52.21 | 15.88,39.46 15.88,39.51 8.96,39.51 | 8.96,39.51 8.96,37.8 8.96,37.58 8.96,36.97 8.96,34.8 C7.- | 8.91,39.46 8.91,39.51 8.96,39.51
  other vias: 3.88,43.32 15.31,23 35.63,23 3.88,2.68 72.69,5.29
  pour Bottom (isolate 0.406): 0.07,54.75 0.07,0.14 77.54,0.14 77.54,54.75
  pour Top (isolate 0.406): 0.07,54.75 0.07,0.14 77.54,0.14 77.54,54.75
GNDA  (via drill 0.6)
  Top 0.305: 52.34,22.2 52.34,21.92 | C24.- 52.34,22.2 | 52.34,22.2 52.34,22.39 | v50.84,28.84 50.84,28.82 50.85,28.82 50.85,25.78 | C24.- 52.54,22.21 50.85,22.21 50.85,25.78 | C20.1 51.61,25.78 50.85,25.78 | 50.85,25.78 50.85,25.79 50.05,25.79 C19.1 | C24.- 57.17,22.2 57.17,19.74 57.19,19.74 57.19,19.75 | 57.21,16.67 57.21,22.18 56.36,22.18
  Bottom 0.305: IC1.28 v50.84,28.84
  pour Top (isolate 0.61): 57.22,19.19 45.79,19.19 45.79,30.62 48.33,30.62 55.95,30.62 55.95,24.27 57.22,24.27
IN/OUT_1  (via drill 0.6)
  Top 0.305: J1.8 49.51,44.59 61.03,44.59 v61.03,42.05
  Bottom 0.305: R35.2 61.98,39.51 61.03,39.51 v61.03,42.05
IN/OUT_2
  Bottom 0.305: J1.16 63.57,39.55 63.57,39.51 64.84,39.51 64.84,37.92 R3.2
N$1
  Bottom 0.305: 18.44,29.31 18.41,29.31 SV3.1 39.58,29.32 39.58,22.45 IC1.21
N$2
  Bottom 0.305: J1.20 53.41,40.9 53.41,44.59 55.95,44.59 55.95,47.13 59.76,47.13 D10.2
N$3
  Bottom 0.305: J1.25 40.71,40.9 40.71,44.59 39.44,44.59 R19.1
N$4  (via drill 0.6)
  Top 0.305: v58.49,38.24 58.49,42.05 49.6,42.05 49.6,40.9 J1.21
  Bottom 0.305: v58.49,38.24 D1.2 | v58.49,38.24
N$5
  Bottom 0.305: D12.1 50.87,50.6 50.87,48.4 49.59,48.4 R37.1
N$6  (via drill 0.6)
  Top 0.305: 41.89,40.78 J1.24 41.89,38.24 v45.79,38.24
  Bottom 0.305: D4.2 50.87,37.95 50.87,38.24 v45.79,38.24
N$7
  Top 0.305: D6.2 10.59,27.38 D7.1
N$8
  Bottom 0.305: R21.1 55.97,36.02 D1.1 58.49,35.7 59.76,35.7 59.76,34.12 R23.2
N$9
  Bottom 0.305: 18.48,31.86 18.48,31.85 | 46.84,25.09 46.87,25.09 | 46.84,25.09 IC1.23 | 46.84,25.09 46.83,25.09 46.83,24.27 41.48,24.27 41.48,31.86 18.48,31.86 | 18.34,31.86 18.34,31.84 | 18.34,31.86 18.48,31.86 | SV3.3 18.34,31.86
N$10
  Bottom 0.305: 23.13,42.65 23.13,42.24 | 23.13,42.65 C8.1 | 23.13,43.15 23.13,42.65
  Bottom 0.406: IC4.4 23.13,42.43 23.13,43.15
N$11
  Top 0.305: D7.2 10.59,24.21 D15.1
N$12
  Bottom 0.305: C9.1 23.13,44.94 23.13,44.42
  Bottom 0.406: IC4.3 21.97,43.7 C9.1
N$13  (via drill 0.6)
  Top 0.305: Q1.2 52.35,12.87 | v50.1,9.04 50.27,9.02 52.11,9.02 C12.2 52.13,8.99 52.67,8.99 53.39,8.27 55.49,8.27 55.49,12.87 Q1.2 | Q1.2 55.45,12.87
  Bottom 0.305: IC1.7 50.05,13.45 50.05,9.31 v50.1,9.04
N$14
  Bottom 0.305: Q4.C 70.34,42.05 74.47,42.05 74.47,2.31 45.79,2.31 45.79,3.95 22.93,3.95 R18.2 R17.2
N$16
  Bottom 0.305: R18.1 22.93,6.49 SV1.1
N$17  (via drill 0.6)
  Top 0.305: Q1.1 44.91,12.87 44.91,10.25 v47.1,10.25 47.06,10.25 C30.2
  Bottom 0.305: IC1.8 49.24,10.49 49.13,10.49 47.1,10.49 v47.1,10.25
N$18
  Bottom 0.305: 17.19,34.37 18.41,34.37 | 18.41,34.37 18.48,34.37 18.48,34.41 | 17.19,34.37 17.17,34.37 | 17.19,34.37 17.19,34.36 17.16,34.33 17.16,31.28 17.88,30.55 40.52,30.55 40.52,23.25 IC1.22 | 18.41,34.37 SV3.5 | SV3.5 | SV3.5 18.41,34.42
N$19
  Bottom 0.305: IC1.24 47.64,25.93 47.11,26.46 46.07,26.46 46.06,26.46 46.06,24.85 42.59,24.85 42.59,32.92 38.1,32.92 38.1,33.56 19.77,33.56 19.77,39.49 18.38,39.49 18.38,39.48 | 18.38,39.48 SV3.9 | 18.38,39.48 18.38,39.45
N$22
  Bottom 0.305: R2.2 69.39,48.74 Q4.B
N$24
  Bottom 0.305: 56.61,15.29 56.55,15.29 | 56.61,15.29 IC1.44 | 56.61,15.29 57.56,15.29 R8.1
N$25
  Bottom 0.305: R24.2 R41.1 55.64,34.41 55.4,34.41 53.79,36.03 R22.1 53.43,36.05 D4.1
N$26
  Top 0.254: 2.27,55.09 0.02,55.09 0.02,52.43
N$27
  Top 0.254: 77.03,1.83 77.03,0 75.41,0
N$28
  Bottom 0.305: R8.2 59.46,11.99 SP1.1
N$30
  Top 0.254: 77.04,53.34 77.04,55.09 75.5,55.09
N$34
  Bottom 0.305: D10.1 58.49,50.62 58.49,48.4 57.24,48.4 R38.2
N$35
  Top 0.254: 1.62,0.02 0.01,0.02 0.01,2.23
N$40
  Bottom 0.254: 2.27,55.09 0,55.09 0,52.46
N$41
  Bottom 0.254: 75.46,55.09 77.02,55.09 77.02,53.34
N$43
  Bottom 0.254: 77.04,1.79 77.04,0 75.4,0
N$44
  Bottom 0.254: 1.6,0 0.01,0 0.01,2.2
N$46
  Bottom 0.305: 19.81,46.24 IC4.1 | 17.74,46.24 17.62,46.88 17.63,46.88 17.63,46.29 18.02,46.17 18.02,41.74 20.54,41.74 20.58,41.68 21.25,41.08 21.25,37.6 R14.1
  Bottom 0.61: 17.74,46.24 19.81,46.24 | 17.63,46.29 17.63,50.51 C5.+ 14.84,53.48 73.73,53.48 73.73,45.77 D2.C
NAPETIE
  Bottom 0.305: IC1.30 52.44,26.4 52.65,26.4 52.65,31.2 51.51,32.33 47.39,32.33 47.39,34.64 40.58,34.64 40.58,38.09 29.06,38.09 29.06,38.9 29.01,38.9 | R15.1 23.26,38.9 25.11,38.9 | 25.11,38.9 25.18,38.9 25.18,37.6 R14.2 | 29.01,38.9 C25.2 | 25.11,38.9 29.01,38.9
PALIVOMER
  Bottom 0.305: R5.2 31.82,47.13 35.63,47.13 35.63,40.9 | 35.63,40.9 35.63,40.78 | J1.26 35.63,40.9
RS
  Bottom 0.305: IC1.15 40.71,17.65 40.71,15.38 R31.1
RSL
  Bottom 0.305: R31.2 35.95,16.65 SV1.10 29.28,17.92 15.31,17.92 | 15.31,17.92 SV2.10 | R34.1 15.31,17.92
RST
  Bottom 0.305: IC1.14 41.98,16.85 41.98,12.84 R27.1
RSTL
  Bottom 0.305: R27.2 34.36,12.84 34.36,15.38 26.74,15.38 | 26.74,15.38 SV1.9 | 12.77,15.38 26.74,15.38 | 12.77,15.38 SV2.9 | R32.2 12.77,15.38
SCL  (via drill 0.6)
  Top 0.2: 11.5,34.43 HS1.1.14
  Top 0.305: 11.5,34.43 11.5,36.94 SV3.8 15.87,38.24 15.9,38.22 19.26,38.22 19.64,38.61 25.47,38.61 25.47,36.29 IC2.6 | IC3.12 20.94,25.79 R26.1 19.12,25.5 v19.12,25.54
  Bottom 0.305: IC1.19 43.95,20.85 43.68,21.12 37.71,21.12 37.71,26.81 19.12,26.81 | 15.96,36.93 15.96,36.95 SV3.8 | SV3.8 12.81,36.95 12.81,26.81 19.12,26.81 | SV3.8 | 19.12,26.81 v19.12,25.54
SDA
  Top 0.2: 11.5,33.17 HS1.1.13
  Top 0.254: 11.5,33.16 11.5,33.17
  Top 0.305: IC3.10 24.16,27.39 23.45,28.1 23.45,29.23 R16.1 19.55,30.62 17.18,30.62 17.18,34.42 | HS1.1.13 | IC2.5 20.27,37.56 20.27,35.72 17.18,35.72 17.18,34.42 | 17.18,34.42 15.87,34.42 SV3.6 15.31,34.4 15.31,34.38 14.04,34.38 14.04,33.16 11.5,33.16
  Bottom 0.305: 45.04,21.76 IC1.20 44.91,21.65 44.84,21.58 44.66,21.76 38.51,21.76 38.51,27.86 14.13,27.86 14.13,34.38 15.76,34.38 15.76,34.39 | 15.76,34.39 15.76,34.43 | SV3.6 15.84,34.4 15.84,34.39 15.76,34.39
TEPLOTA  (via drill 0.6)
  Top 0.305: J1.13 34.36,43.44 v34.36,43.32
  Bottom 0.305: R9.1 32.93,44.98 32.99,44.98 32.99,44.2 | R10.1 32.99,42.79 32.99,43.32 | 32.99,43.32 32.99,44.2 | 32.99,44.2 33.09,44.2 33.1,43.44 | 32.99,43.32 v34.36,43.32
TL_STOP
  Bottom 0.305: J1.22 48.33,40.9 48.33,47.13 52.14,47.13 D12.2
UP_15
  Bottom 0.305: IC1.40 57.91,18.45 58.09,18.27 62.65,18.27 63.57,19.19 68.8,19.19 68.8,21.28 70.24,21.28 R6.2
UP_BACKLIGHT  (via drill 0.6)
  Top 0.305: v67.38,23.27 67.38,39.51 66.11,39.51 v66.11,42.05
  Bottom 0.305: 56.71,23.24 56.67,23.28 IC1.34 67.38,23.25 v67.38,23.27 | 62.31,50.62 R39.1 | 62.31,50.62 R40.2 64.84,50.64 R2.1 | 62.31,50.62 66.11,50.62 v66.11,42.05
UP_CERPADLO  (via drill 0.6)
  Top 0.305: v64.84,14.11 v64.84,33.16
  Bottom 0.305: R4.1 | R4.1 70.17,14.1 C1.1 | R4.1 v64.84,14.1 v64.84,14.11 61.03,14.11 61.03,16.05 IC1.43 | v64.84,33.16 62.3,33.16 62.3,35.7 61.02,35.7 R25.1
UP_IN/OUT_1  (via drill 0.6)
  Top 0.305: v66.11,21.73 v66.11,31.89
  Bottom 0.305: R11.2 70.19,29.34 C36.2 v66.11,31.89 66.11,34.43 63.57,34.43 R35.1 | IC1.36 64.84,21.65 v66.11,21.73
UP_IN/OUT_2  (via drill 0.6)
  Top 0.305: v68.65,22.45 v68.65,35.7
  Bottom 0.305: 70.21,35.7 C26.2 | 70.21,35.7 70.21,36.02 68.65,36.02 | 68.65,36.02 R3.1 | R36.2 70.25,35.7 70.21,35.7 | v68.65,35.7 68.65,36.02 | v68.65,22.45 68.65,22.31 68.56,22.22 67.03,22.22 66.6,22.64 65.48,22.64 65.29,22.45 IC1.35
UP_IN/OUT_3
  Bottom 0.305: 54.84,25.09 54.78,25.09 | IC1.33 54.84,25.09 | 54.84,25.09 54.84,25.68 54.83,25.69 54.83,25.83 54.77,25.83 54.77,33.83 53.76,34.84 49.6,34.84 49.6,36.97 43.25,36.97 43.25,48.73 | 43.25,48.73 R1.2 41.99,48.4 40.71,48.4 40.71,50.63 R19.2 | 43.25,48.73 44.45,48.73 arc-90 C16.2
UP_PALIVOMER
  Bottom 0.305: 54.02,25.08 IC1.32 54.04,25.08 54.01,25.9 54.01,33.16 53.19,33.98 49.03,33.98 49.03,36.19 42.32,36.19 42.32,39.64 38.07,39.64 38.07,48.68 C13.2 34.34,48.68 R7.2 34.34,48.4 33.09,48.4 33.09,50.63 R5.1
UP_RYCHLOST  (via drill 0.6)
  Top 0.305: v63.58,17.64 63.57,23.99 v63.57,24.27
  Bottom 0.305: R12.1 C2.1 70.18,24.27 v63.57,24.27 63.57,31.89 61.03,31.89 R23.1 | IC1.41 61.04,17.65 v63.58,17.64
UP_TEPLOTA
  Bottom 0.305: IC1.31 53.24,26.08 53.41,26.08 53.41,31.89 52.14,33.16 48.33,33.16 48.33,35.38 41.43,35.38 41.43,38.75 33.36,38.75 33.36,41.07 30.96,41.07 30.96,42.54 30.97,42.54 R10.2 31,42.64 31,42.62 29.11,42.62 C18.2
UP_TL_START  (via drill 0.6)
  Top 0.305: v54.72,39.38 54.74,39.38 54.74,36.97 48.33,36.97 48.33,29.32 46.04,29.32 v46.04,28.59
  Bottom 0.305: IC1.25 48.44,25.1 48.43,25.11 48.44,25.13 48.44,26.16 47.05,27.55 46.18,27.55 46.04,27.69 v46.04,28.59 | R38.1 55.95,50.61 55.95,48.4 54.67,48.4 | 54.67,48.4 C14.1 | 54.67,48.4 54.67,45.86 50.87,45.86 50.87,39.51 54.72,39.51 v54.72,39.38
UP_TL_STOP  (via drill 0.6)
  Top 0.305: v45.71,42.21 45.79,42.21 45.79,39.51 47.06,39.51 v47.06,30.24
  Bottom 0.305: IC1.26 49.24,26.34 48.21,27.36 48.21,30.24 v47.06,30.24 | R37.2 48.33,50.62 48.33,48.4 47.06,48.4 C17.2 45.79,48.69 45.79,42.21 v45.71,42.21
UP_VSTREKOVAC  (via drill 0.6)
  Top 0.305: v62.3,16.64 v62.3,30.62
  Bottom 0.305: C4.1 70.24,19.19 R13.1 v62.3,16.64 62.3,16.85 IC1.42 | R24.1 58.48,30.62 v62.3,30.62
V+  (via drill 0.6)
  Top 0.305: 24.11,49.21 24.11,49.17 IC5.1 24.1,49.17 | 24.1,49.17 24.1,49.2 | 24.1,49.17 25.08,49.17 26.34,50.43 27.79,50.43 27.79,52.21 73.73,52.21 73.73,21.68 v72.69,21.68
  Bottom 0.305: 31.03,44.98 31.08,44.98 | 31.03,44.98 R9.2 | C11.2 29.15,44.98 31.03,44.98 | C11.2 29.07,45.06 28.84,45.06 | 24.22,49.16 IC5.1 25.4,47.79 25.4,47.13 28.01,47.13 29.28,45.86 29.28,45.18 C11.2 | v72.69,21.68 72.69,21.71 R6.1
(copper drawn outside any net)
  shapes: Bottom circle x2, Top circle x3

### Text on the board
Top: T
Bottom: B
tStop: BC 09 | 10 | PPF
bStop: BC 09